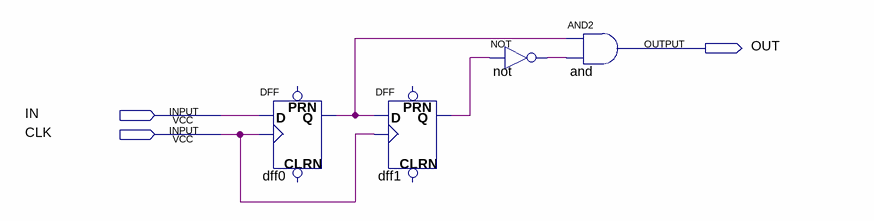
[diagram p0: schematic sheet]
// Quartus schematic RisingEdge.bdf as structural Verilog: 4 symbols, 3 pins
module RisingEdge (
  input  IN,
  input  CLK,
  output OUT
);

  wire dff0_q, dff1_q, not_out;

  DFF dff0 (.CLK(CLK), .D(IN), .Q(dff0_q));  // open: CLRN, PRN
  DFF dff1 (.CLK(CLK), .D(dff0_q), .Q(dff1_q));  // open: CLRN, PRN
  not \not  (not_out, dff1_q);
  and \and  (OUT, dff0_q, not_out);
endmodule
